# EasyEDA schematic SCH_Esp32-LED-board_2025-09-09.json
TITLE: ESP32 WLED Driver Board; REV: 1.0; Date: 2025-07-11; Sheet: 1/1; Drawn By: Logan Edwards; Company: Edwards Engineering
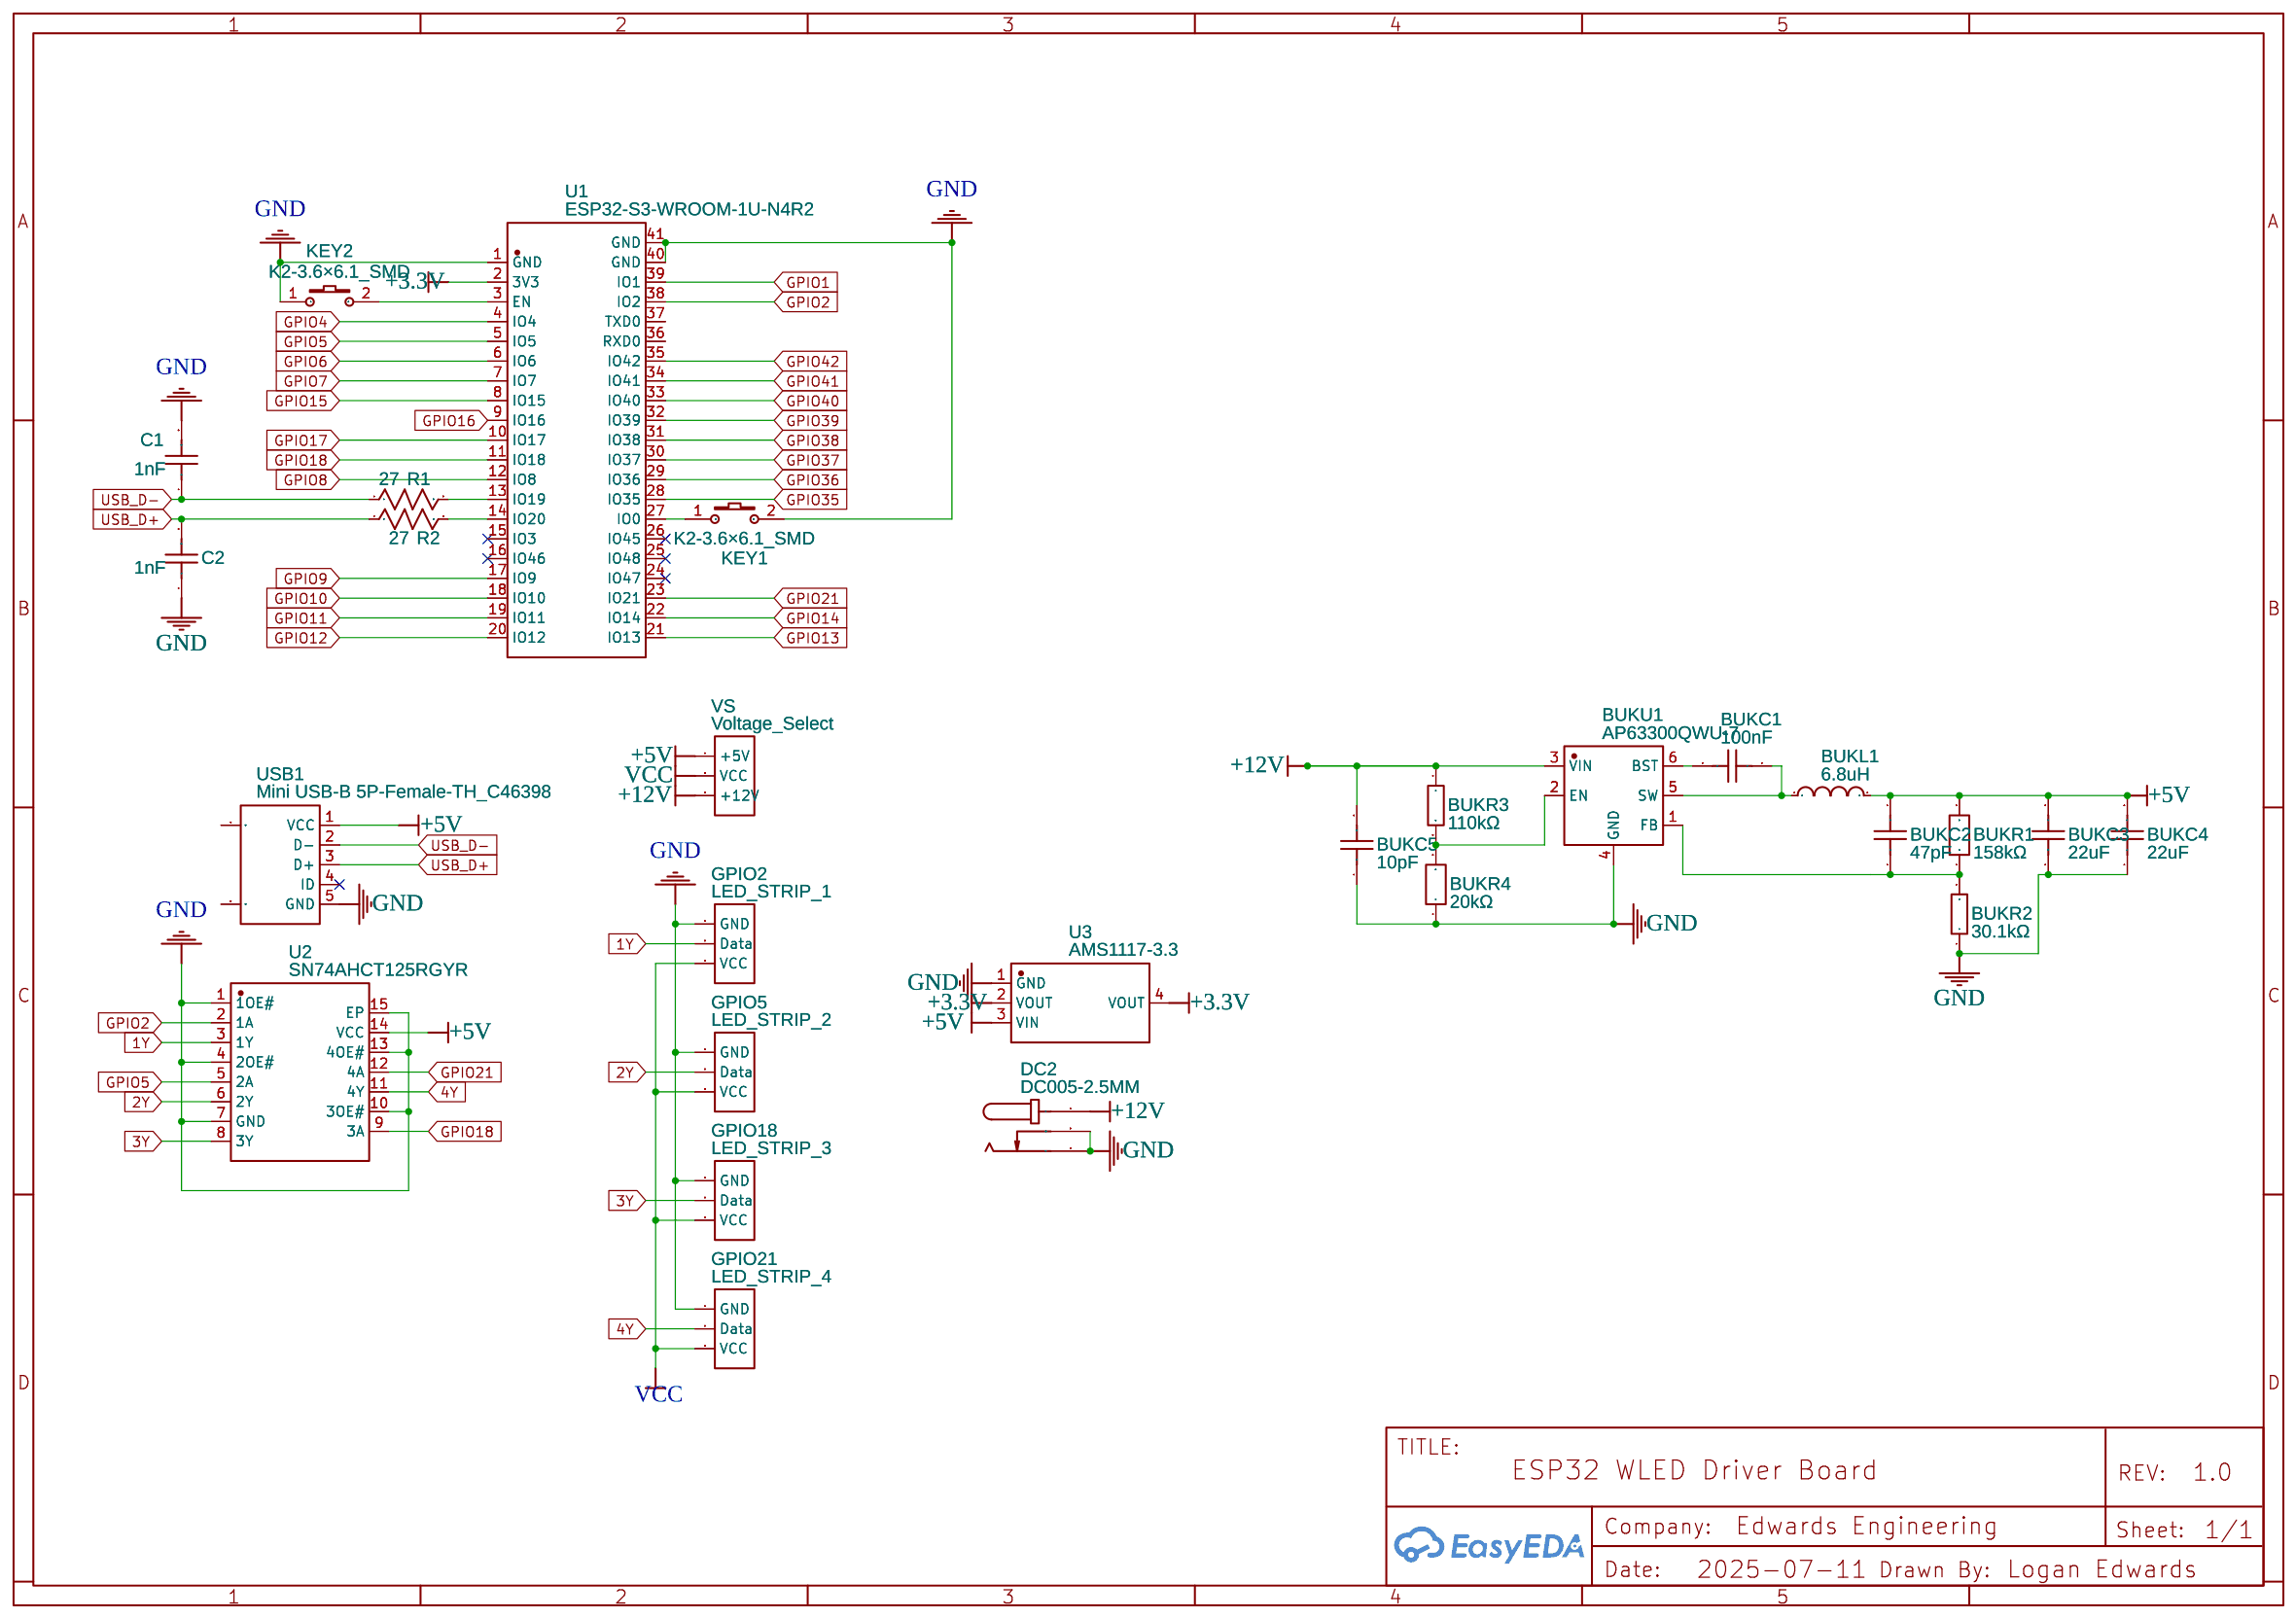
[diagram p0: schematic sheet]

## Parts
BUKC1  100nF  [C0603]
BUKC2  47pF  [C0603]
BUKC3  22uF  [C0603]
BUKC4  22uF  [C0603]
BUKC5  10pF  [C0603]
BUKL1  6.8uH  [L0603]
BUKR1  158kΩ  [R0603]
BUKR2  30.1kΩ  [R0603]
BUKR3  110kΩ  [R0603]
BUKR4  20kΩ  [R0603]
BUKU1  AP63300QWU-7  [TSOT-26-6_L2.9-W1.6-P0.95-LS2.8-BR]
C1  1nF  [C0603]
C2  1nF  [C0603]
DC2  DC005-2.5MM  [DC-IN-TH_DC-005-20A-1]
GPIO2  LED_STRIP_1  [5V LED WS2814 CONNECTOR]
GPIO5  LED_STRIP_2  [5V LED WS2814 CONNECTOR]
GPIO18  LED_STRIP_3  [5V LED WS2814 CONNECTOR]
GPIO21  LED_STRIP_4  [5V LED WS2814 CONNECTOR]
KEY1  K2-3.6×6.1_SMD  [KEY-SMD_2P-L6.2-W3.6-LS8.0]
KEY2  K2-3.6×6.1_SMD  [KEY-SMD_2P-L6.2-W3.6-LS8.0]
R1  27  [R0603]
R2  27  [R0603]
U1  ESP32-S3-WROOM-1U-N4R2  [WIRELM-SMD_ESP32-S3-WROOM-1U]
U2  SN74AHCT125RGYR  [VQFN-14_L3.5-W3.5-P0.50-BL-EP]
U3  AMS1117-3.3  [SOT-223-3_L6.5-W3.4-P2.30-LS7.0-BR]
USB1  Mini USB-B 5P-Female-TH_C46398  [MINI-USB-TH_USB-MINI-2]
VS  Voltage_Select  [12/5V VOLTAGE SELECT]

## Library data of the parts
BUKC1 = 0603B104J250NT: Supplier: LCSC; Supplier Part: C2991729; Manufacturer: FH(风华); Contributor: lcsc; JLCPCB Part Class: Extended Part
BUKC2 = 0603C0G470J500NT: Supplier: LCSC; Supplier Part: C48579260; Manufacturer: AIDE(爱迪电容); JLCPCB Part Class: Extended Part; Contributor: lcsc
BUKC3 BUKC4 = HGC0603R5226M160NTHJ: Supplier: LCSC; Supplier Part: C22367828; Manufacturer: Chinocera(华瓷); JLCPCB Part Class: Extended Part; Contributor: lcsc
BUKC5 = CC0603FRNPO0BN100: Supplier: LCSC; Supplier Part: C576764; Manufacturer: YAGEO(国巨); JLCPCB Part Class: Extended Part; Contributor: lcsc
BUKL1 = CMP160808JE6R8MT: Contributor: LCSC; Supplier: LCSC; Supplier Part: C395003; Manufacturer: FH(风华); JLCPCB Part Class: Extended Part
BUKR1 = FRC0603F1583TS: Contributor: lcsc; Supplier: LCSC; Supplier Part: C2974029; Manufacturer: FOJAN(富捷); JLCPCB Part Class: Extended Part
BUKR2 = RMC060330.1K1%N: Contributor: LCSC; Supplier: LCSC; Supplier Part: C325686; Manufacturer: Tyohm(幸亚电阻); JLCPCB Part Class: Extended Part
BUKR3 = RT0603BRD07110KL: Contributor: LCSC; Supplier: LCSC; Supplier Part: C326736; Manufacturer: YAGEO(国巨); JLCPCB Part Class: Extended Part
BUKR4 = RT0603CRE0720KL: Contributor: LCSC; Supplier: LCSC; Supplier Part: C705914; Manufacturer: YAGEO(国巨); JLCPCB Part Class: Extended Part
BUKU1 = AP63300QWU-7: Supplier: LCSC; Supplier Part: C5248538; Manufacturer: DIODES(美台); JLCPCB Part Class: Extended Part; Contributor: lcsc
C1 C2 = C_0603_US: Supplier Part: C1588; Supplier: JLCPCB; Contributor: LCEDA_Lib; Manufacturer Part: CL10B102KB8NNNC; Manufacturer: Samsung Electro-Mechanics
DC2 = DC005-2.5MM: Supplier: LCSC; Manufacturer: SOFNG(硕方); Manufacturer Part: DC005-T25; Supplier Part: C111573; JLCPCB Part Class: Extended Part
GPIO2 GPIO5 GPIO18 GPIO21 VS = Header-Male-2.54_1x3: Supplier: LCSC; Manufacturer: BOOMELE(博穆精密); Manufacturer Part: 2.54-1*3P针; Supplier Part: C49257; JLCPCB Part Class: Extended Part
KEY1 KEY2 = K2-3.6×6.1_SMD: Supplier Part: C118141; Supplier: LCSC; Manufacturer Part: K2-1107ST-A4SW-06; Contributor: LCEDA_Lib; 制造商: 韩国韩荣
R1 R2 = R_0603_US: Supplier Part: C25190; Supplier: JLCPCB; Contributor: LCEDA_Lib; Manufacturer Part: 0603WAF270JT5E; Manufacturer: UNI-ROYAL(Uniroyal Elec)
U1 = ESP32-S3-WROOM-1U-N4R2: Contributor: lcsc; Supplier: LCSC; Supplier Part: C3013942; Manufacturer: ESPRESSIF(乐鑫); JLCPCB Part Class: Extended Part
U2 = SN74AHCT125RGYR: Contributor: LCSC; Supplier: LCSC; Supplier Part: C2675532; Manufacturer: TI(德州仪器); JLCPCB Part Class: Extended Part
U3 = AMS1117-3.3: sourceId: dwIGgezVh; Supplier: LCSC; Manufacturer: AMS; Supplier Part: C6186; JLCPCB Part Class: Basic Part
USB1 = Mini USB-B 5P-Female-TH_C46398: Supplier: LCSC; Manufacturer: 精拓金; Manufacturer Part: 920-462A2021D10102; Supplier Part: C46398; JLCPCB Part Class: Extended Part

## Nets
+3.3V: U1.2(3V3) U3.2(VOUT) U3.4(VOUT)
+5V: BUKC2.2 BUKC3.2 BUKC4.2 BUKL1.2 BUKR1.2 U2.14(VCC) U3.3(VIN) USB1.1(VCC) VS.1(+5V)
+12V: BUKC5.2 BUKR3.1 BUKU1.3(VIN) DC2.1 VS.3(+12V)
GND: BUKC3.1 BUKC4.1 BUKC5.1 BUKR2.1 BUKR4.1 BUKU1.4(GND) C1.2 C2.1 DC2.2 DC2.3 GPIO2.1(GND) GPIO5.1(GND) GPIO18.1(GND) GPIO21.1(GND) KEY1.2 KEY2.1 U1.1(GND) U1.40(GND) U1.41(GND) U2.1(1OE#) U2.4(2OE#) U2.7(GND) U2.10(3OE#) U2.13(4OE#) U2.15(EP) U3.1(GND) USB1.5(GND)
VCC: GPIO2.3(VCC) GPIO5.3(VCC) GPIO18.3(VCC) GPIO21.3(VCC) VS.2(VCC)
1Y: GPIO2.2(Data) U2.3(1Y)
2Y: GPIO5.2(Data) U2.6(2Y)
3Y: GPIO18.2(Data) U2.8(3Y)
4Y: GPIO21.2(Data) U2.11(4Y)
GPIO1: U1.39(IO1)
GPIO2: U1.38(IO2) U2.2(1A)
GPIO4: U1.4(IO4)
GPIO5: U1.5(IO5) U2.5(2A)
GPIO6: U1.6(IO6)
GPIO7: U1.7(IO7)
GPIO8: U1.12(IO8)
GPIO9: U1.17(IO9)
GPIO10: U1.18(IO10)
GPIO11: U1.19(IO11)
GPIO12: U1.20(IO12)
GPIO13: U1.21(IO13)
GPIO14: U1.22(IO14)
GPIO15: U1.8(IO15)
GPIO16: U1.9(IO16)
GPIO17: U1.10(IO17)
GPIO18: U1.11(IO18) U2.9(3A)
GPIO21: U1.23(IO21) U2.12(4A)
GPIO35: U1.28(IO35)
GPIO36: U1.29(IO36)
GPIO37: U1.30(IO37)
GPIO38: U1.31(IO38)
GPIO39: U1.32(IO39)
GPIO40: U1.33(IO40)
GPIO41: U1.34(IO41)
GPIO42: U1.35(IO42)
USB_D+: C2.2 R2.1 USB1.3(D+)
USB_D-: C1.1 R1.1 USB1.2(D-)
Net-(BUKC1-1): BUKC1.1 BUKU1.6(BST)
Net-(BUKC1-2): BUKC1.2 BUKL1.1 BUKU1.5(SW)
Net-(BUKC2-1): BUKC2.1 BUKR1.1 BUKR2.2 BUKU1.1(FB)
Net-(BUKR3-2): BUKR3.2 BUKR4.2 BUKU1.2(EN)
Net-(KEY1-1): KEY1.1 U1.27(IO0)
Net-(KEY2-2): KEY2.2 U1.3(EN)
Net-(R1-2): R1.2 U1.13(IO19)
Net-(R2-2): R2.2 U1.14(IO20)

Not connected (* = marked no-connect by the designer): U1 15(IO3)* 16(IO46)* 24(IO47)* 25(IO48)* 26(IO45)* 36(RXD0) 37(TXD0); USB1 0 4(ID)*
